# EAGLE design ATESLEME (EAGLE 9.6.2)

## Sheet 1 of 5
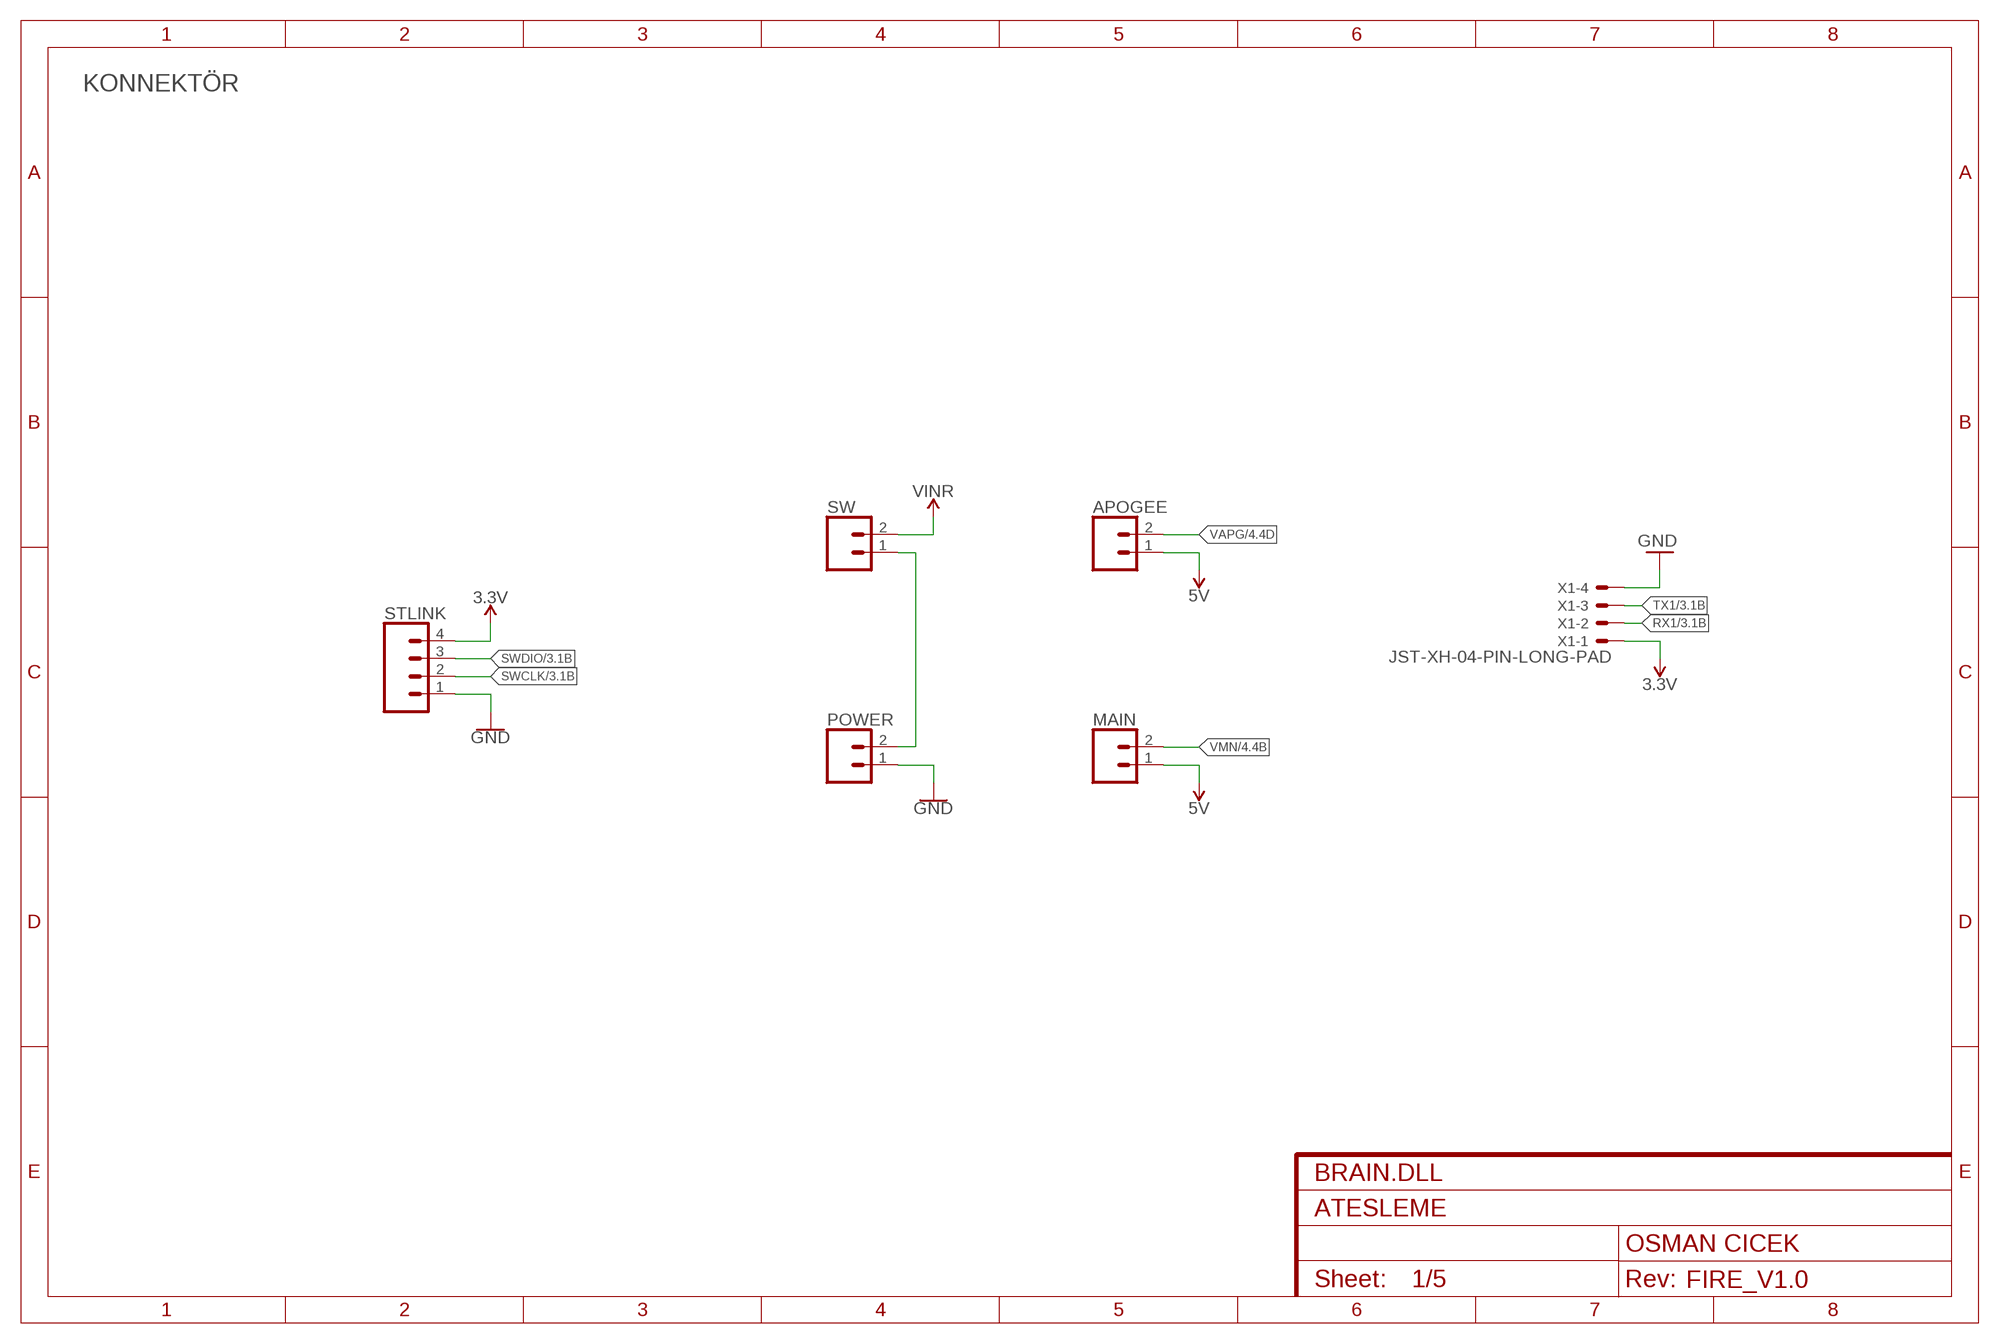
[diagram p0: schematic, sheet 1]
FRAME1 (FRAME-A4L): ATESLEME: PART1; CNAME: BRAIN.DLL; CREVISION: FIRE_V1.0; DESIGNER: OSMAN CICEK

### Parts
APOGEE  CONN_023.5MM-NO_SILK  [SCREWTERMINAL-3.5MM-2-NS]
MAIN  CONN_023.5MM-NO_SILK  [SCREWTERMINAL-3.5MM-2-NS]
POWER  CONN_023.5MM-NO_SILK  [SCREWTERMINAL-3.5MM-2-NS]
STLINK  CONN_04  [1X04]
SW  CONN_023.5MM-NO_SILK  [SCREWTERMINAL-3.5MM-2-NS]
X1  JST-XH-04-PIN-LONG-PAD  [JST-XH-04-PACKAGE-LONG-PAD]

### Nets
3.3V: STLINK.4 X1.1 ; also sheet 2,3,5
5V: APOGEE.1 MAIN.1 ; also sheet 2
GND: POWER.1 STLINK.1 X1.4 ; also sheet 2,3,4,5
N$9: POWER.2 SW.1
RX1: X1.2 ; also sheet 3
SWCLK: STLINK.2 ; also sheet 3
SWDIO: STLINK.3 ; also sheet 3
TX1: X1.3 ; also sheet 3
VAPG: APOGEE.2 ; also sheet 4
VIN: SW.2 ; supply symbol labelled VINR ; also sheet 2
VMN: MAIN.2 ; also sheet 4

### Notes on the sheet
- KONNEKTÖR

## Sheet 2 of 5
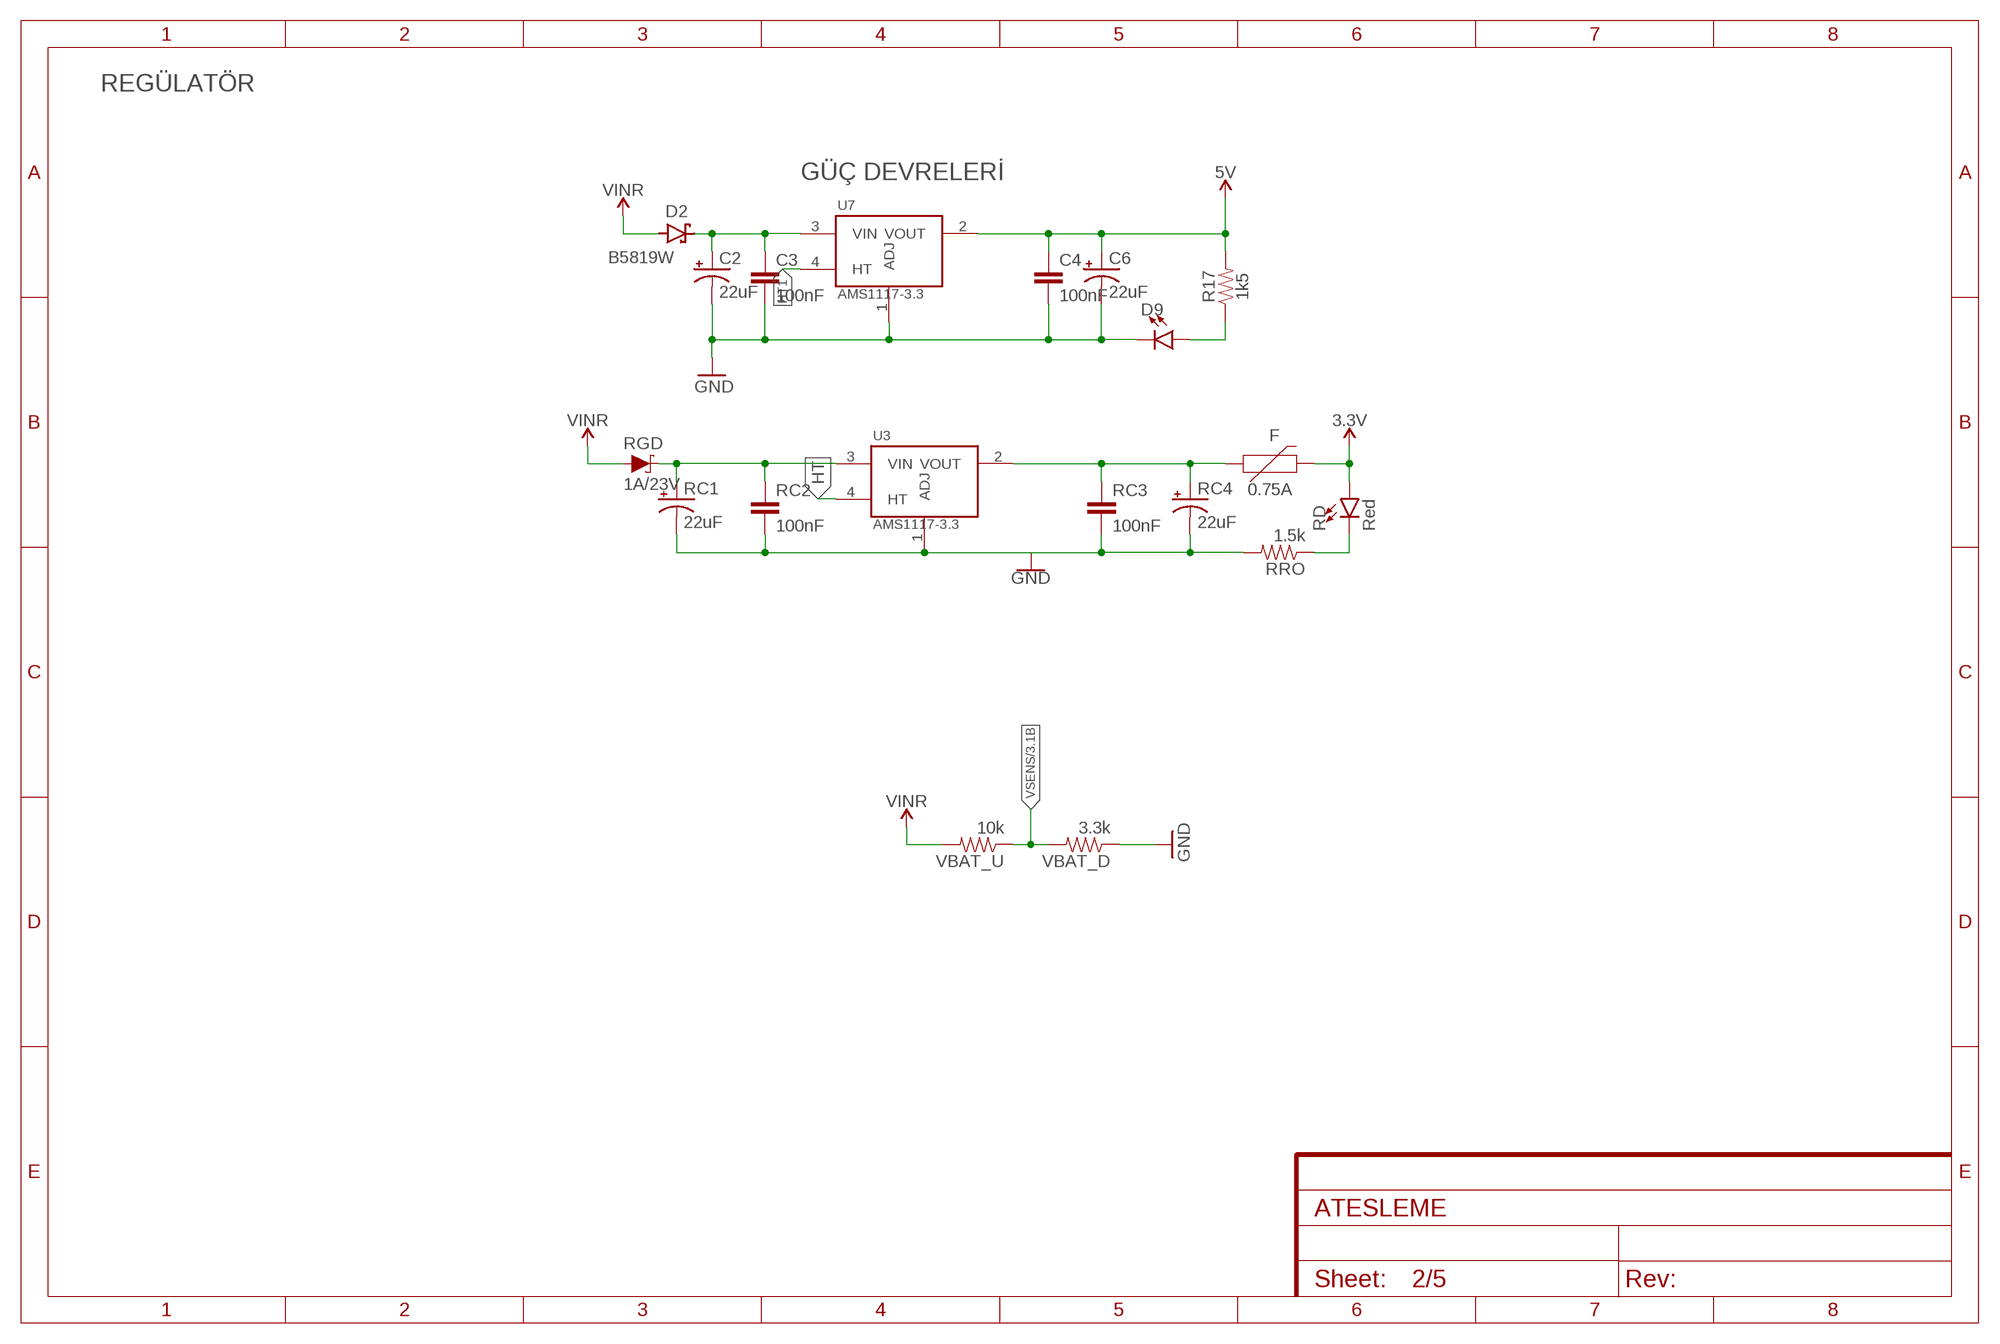
[diagram p1: schematic, sheet 2]

### Parts
C2  22uF  47UF-POLAR-EIA3528-10V-10%  [EIA3528]
C3  100nF  1.0UF-0603-16V-10%  [0603]
C4  100nF  1.0UF-0603-16V-10%  [0603]
C6  22uF  47UF-POLAR-EIA3528-10V-10%  [EIA3528]
D2  B5819W  SCHOTTKY_MBR0520LT1GDO-219  [SODFL3718X115]
D9  LED0603  [LED-0603]
F  0.75A  PPTC_THREE-QUARTER-AMP  [1206]
R17  1k5  1KOHM-0603-1/10W-1%  [0603]
RC1  22uF  10UF-POLAR-EIA3528-20V-10%(TANT)  [EIA3528]
RC2  100nF  0.1UF-0603-25V-(+80/-20%)  [0603]
RC3  100nF  0.1UF-0603-25V-(+80/-20%)  [0603]
RC4  22uF  10UF-POLAR-EIA3528-20V-10%(TANT)  [EIA3528]
RD  Red  LED-RED0603-SMART  [LED-0603]
RGD  1A/23V  DIODE-SCHOTTKY-BAT20J  [SOD-323]
RRO  1.5k  2.0KOHM1/10W5%(0603)  [0603-RES]
U3  AMS1117-3.3  [SOT229P700X180-4N]
U7  AMS1117-3.3  [SOT229P700X180-4N]
VBAT_D  3.3k  2.0KOHM1/10W5%(0603)  [0603-RES]
VBAT_U  10k  2.0KOHM1/10W5%(0603)  [0603-RES]

### Nets
3.3V: F.2 RD.A ; also sheet 1,3,5
5V: C4.1 C6.A(+) R17.2 U7.2(VOUT) ; also sheet 1
GND: C2.C(-) C3.2 C4.2 C6.C(-) D9.C RC1.C(-) RC2.2 RC3.2 RC4.C(-) RRO.2 U3.1(ADJ) U7.1(ADJ) VBAT_D.1 ; also sheet 1,3,4,5
HT: U3.4(HT)
HT1: U7.4(HT)
N$1: F.1 RC3.1 RC4.A(+) U3.2(VOUT)
N$2: RD.C RRO.1
N$7: C2.A(+) C3.1 D2.1(C) U7.3(VIN)
N$11: D9.A R17.1
VIN: D2.2(A) RGD.A VBAT_U.2 ; supply symbol labelled VINR ; also sheet 1
VNR: RC1.A(+) RC2.1 RGD.C U3.3(VIN)
VSENS: VBAT_D.2 VBAT_U.1 ; also sheet 3

### Notes on the sheet
- REGÜLATÖR
- GÜÇ DEVRELERİ

## Sheet 3 of 5
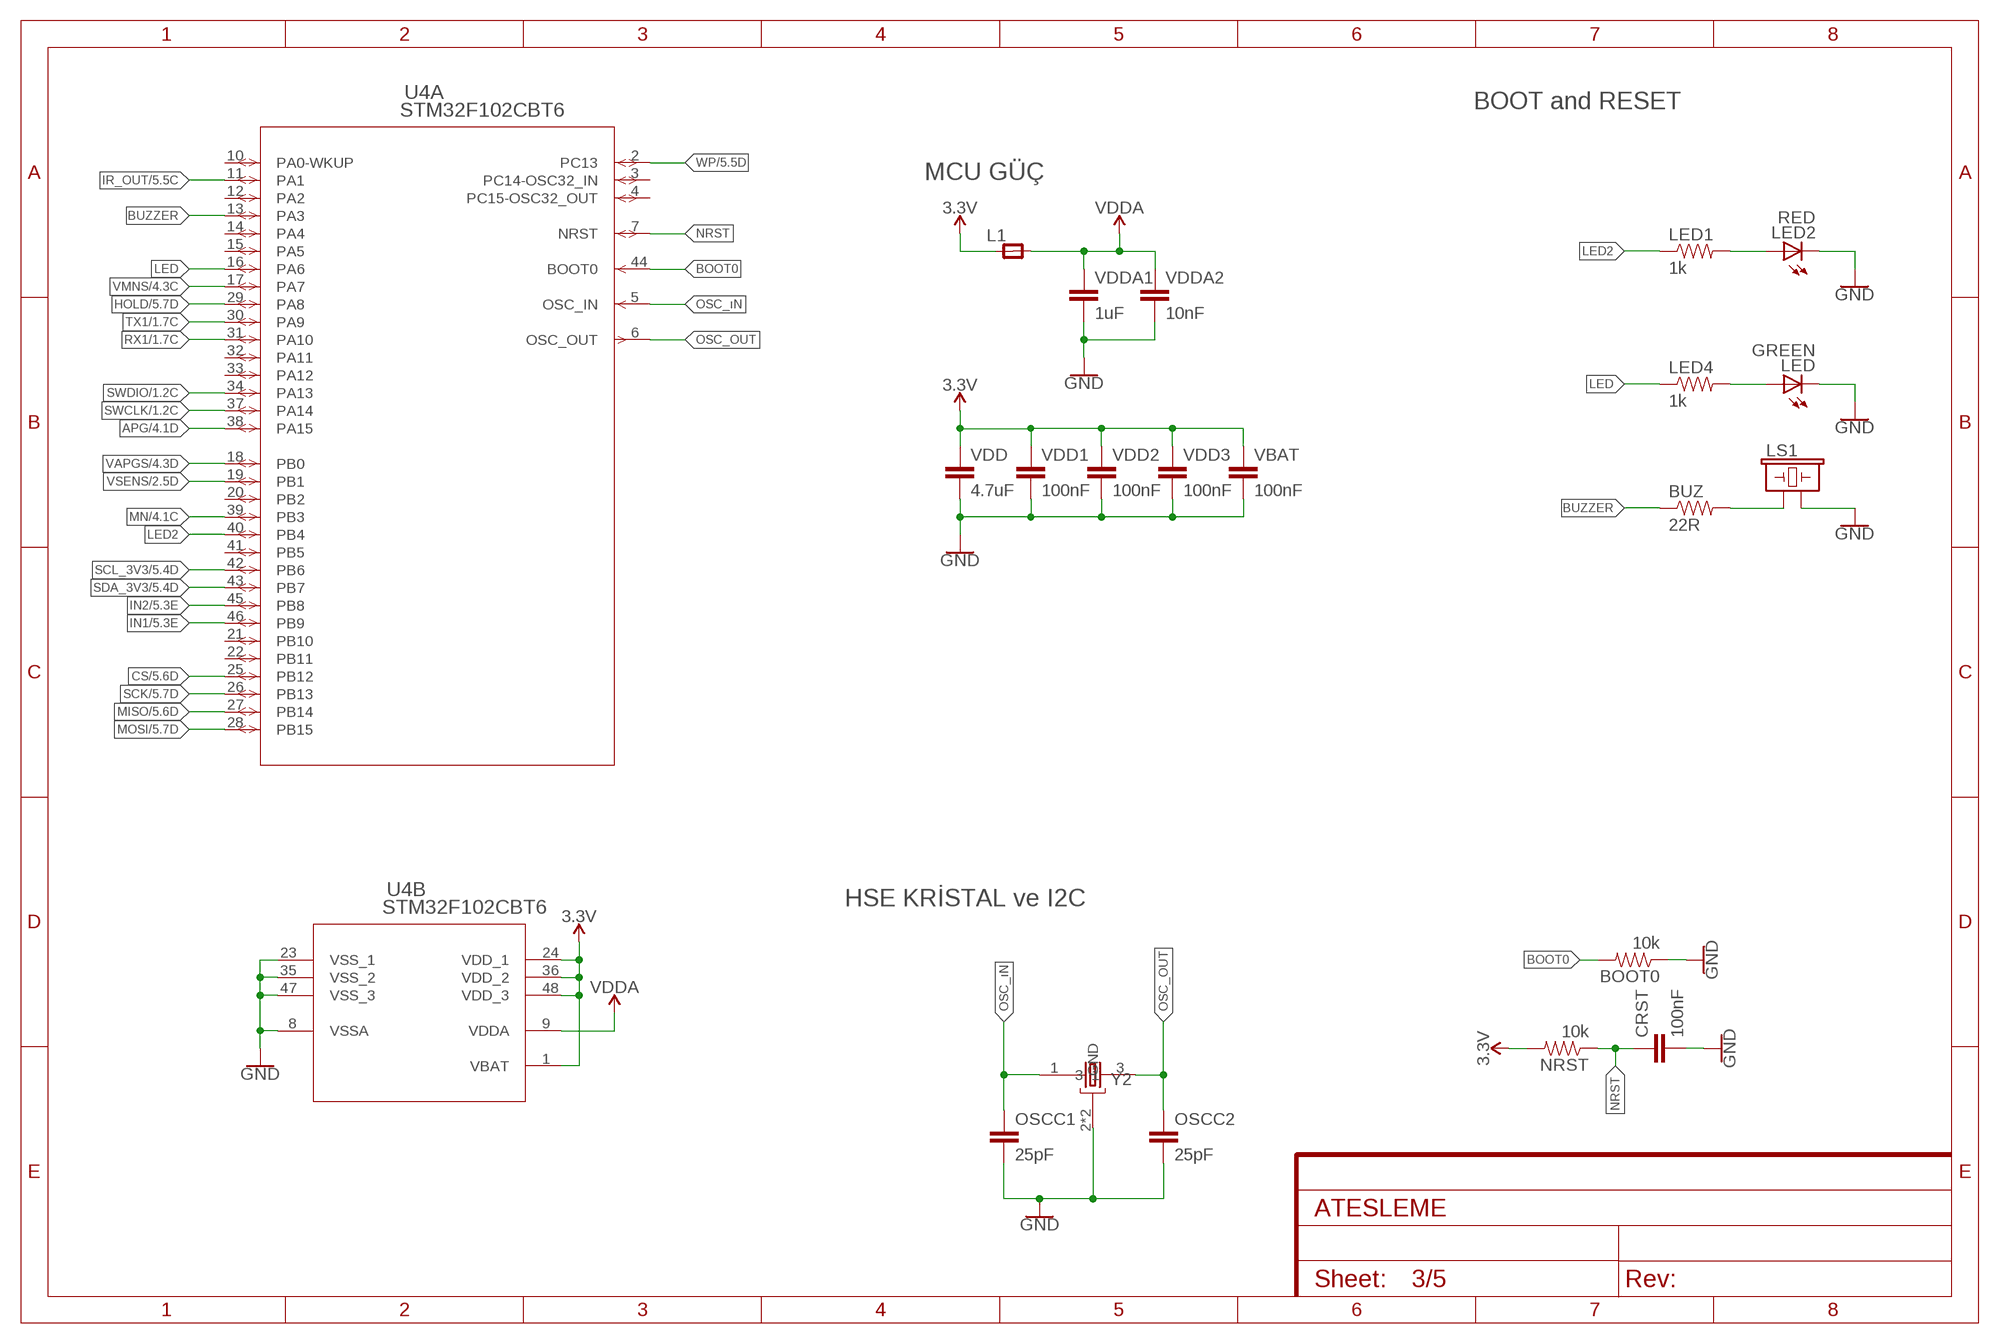
[diagram p2: schematic, sheet 3]

### Parts
BOOT0  10k  2.0KOHM1/10W5%(0603)  [0603-RES]
BUZ  22R  2.0KOHM1/10W5%(0603)  [0603-RES]
CRST  100nF  0.1UF-0603-25V-(+80/-20%)  [0603]
L1  RC-MASTER-SMD_FB_0805MP  [RC-MASTER-SMD_L0805MP]
LED  GREEN  LED-RED0603  [LED-0603]
LED1  1k  2.0KOHM1/10W5%(0603)  [0603-RES]
LED2  RED  LED-RED0603  [LED-0603]
LED4  1k  2.0KOHM1/10W5%(0603)  [0603-RES]
LS1  BUZZER-PTH  [BUZZER-12MM]
NRST  10k  2.0KOHM1/10W5%(0603)  [0603-RES]
OSCC1  25pF  0.1UF-0603-25V-(+80/-20%)  [0603]
OSCC2  25pF  0.1UF-0603-25V-(+80/-20%)  [0603]
U4  STM32F102CBT6  [LQFP48-7X7MM]
VBAT  100nF  0.1UF-0603-25V-(+80/-20%)  [0603]
VDD  4.7uF  0.1UF-0603-25V-(+80/-20%)  [0603]
VDD1  100nF  0.1UF-0603-25V-(+80/-20%)  [0603]
VDD2  100nF  0.1UF-0603-25V-(+80/-20%)  [0603]
VDD3  100nF  0.1UF-0603-25V-(+80/-20%)  [0603]
VDDA1  1uF  0.1UF-0603-25V-(+80/-20%)  [0603]
VDDA2  10nF  0.1UF-0603-25V-(+80/-20%)  [0603]
Y2  ABM2B-8.000MHZ-10-1-U-T  ABM3B-26.000MHZ-10-1-U-T  [OSCCC500X320X110-4N]

### Nets
3.3V: L1.1 NRST.2 U4.1(B:VBAT) U4.24(B:VDD_1) U4.36(B:VDD_2) U4.48(B:VDD_3) VBAT.1 VDD1.1 VDD2.1 VDD3.1 VDD.1 ; also sheet 1,2,5
APG: U4.38(A:PA15) ; also sheet 4
BOOT0: BOOT0.2 U4.44(A:BOOT0)
BUZZER: BUZ.1 U4.13(A:PA3)
CS: U4.25(A:PB12) ; also sheet 5
GND: BOOT0.1 CRST.2 LED2.C LED.C LS1.- OSCC1.2 OSCC2.2 U4.8(B:VSSA) U4.23(B:VSS_1) U4.35(B:VSS_2) U4.47(B:VSS_3) VBAT.2 VDD1.2 VDD2.2 VDD3.2 VDD.2 VDDA1.2 VDDA2.2 Y2.2(GND) Y2.4(GND) ; also sheet 1,2,4,5
HOLD: U4.29(A:PA8) ; also sheet 5
IN1: U4.46(A:PB9) ; also sheet 5
IN2: U4.45(A:PB8) ; also sheet 5
IR_OUT: U4.11(A:PA1) ; also sheet 5
LED: LED4.1 U4.16(A:PA6)
LED2: LED1.1 U4.40(A:PB4)
MISO: U4.27(A:PB14) ; also sheet 5
MN: U4.39(A:PB3) ; also sheet 4
MOSI: U4.28(A:PB15) ; also sheet 5
N$6: LED1.2 LED2.A
N$10: LED4.2 LED.A
N$13: BUZ.2 LS1.+
NRST: CRST.1 NRST.1 U4.7(A:NRST)
OSC_OUT: OSCC2.1 U4.6(A:OSC_OUT) Y2.3
OSC_ıN: OSCC1.1 U4.5(A:OSC_IN) Y2.1
RX1: U4.31(A:PA10) ; also sheet 1
SCK: U4.26(A:PB13) ; also sheet 5
SCL_3V3: U4.42(A:PB6) ; also sheet 5
SDA_3V3: U4.43(A:PB7) ; also sheet 5
SWCLK: U4.37(A:PA14) ; also sheet 1
SWDIO: U4.34(A:PA13) ; also sheet 1
TX1: U4.30(A:PA9) ; also sheet 1
VAPGS: U4.18(A:PB0) ; also sheet 4
VDDA: L1.2 U4.9(B:VDDA) VDDA1.1 VDDA2.1
VMNS: U4.17(A:PA7) ; also sheet 4
VSENS: U4.19(A:PB1) ; also sheet 2
WP: U4.2(A:PC13) ; also sheet 5
Unconnected: U4.3(A:PC14-OSC32_IN) U4.4(A:PC15-OSC32_OUT) U4.10(A:PA0-WKUP) U4.12(A:PA2) U4.14(A:PA4) U4.15(A:PA5) U4.20(A:PB2) U4.21(A:PB10) U4.22(A:PB11) U4.32(A:PA11) U4.33(A:PA12) U4.41(A:PB5)

### Notes on the sheet
- BOOT and RESET
- MCU GÜÇ
- HSE KRİSTAL ve I2C

## Sheet 4 of 5
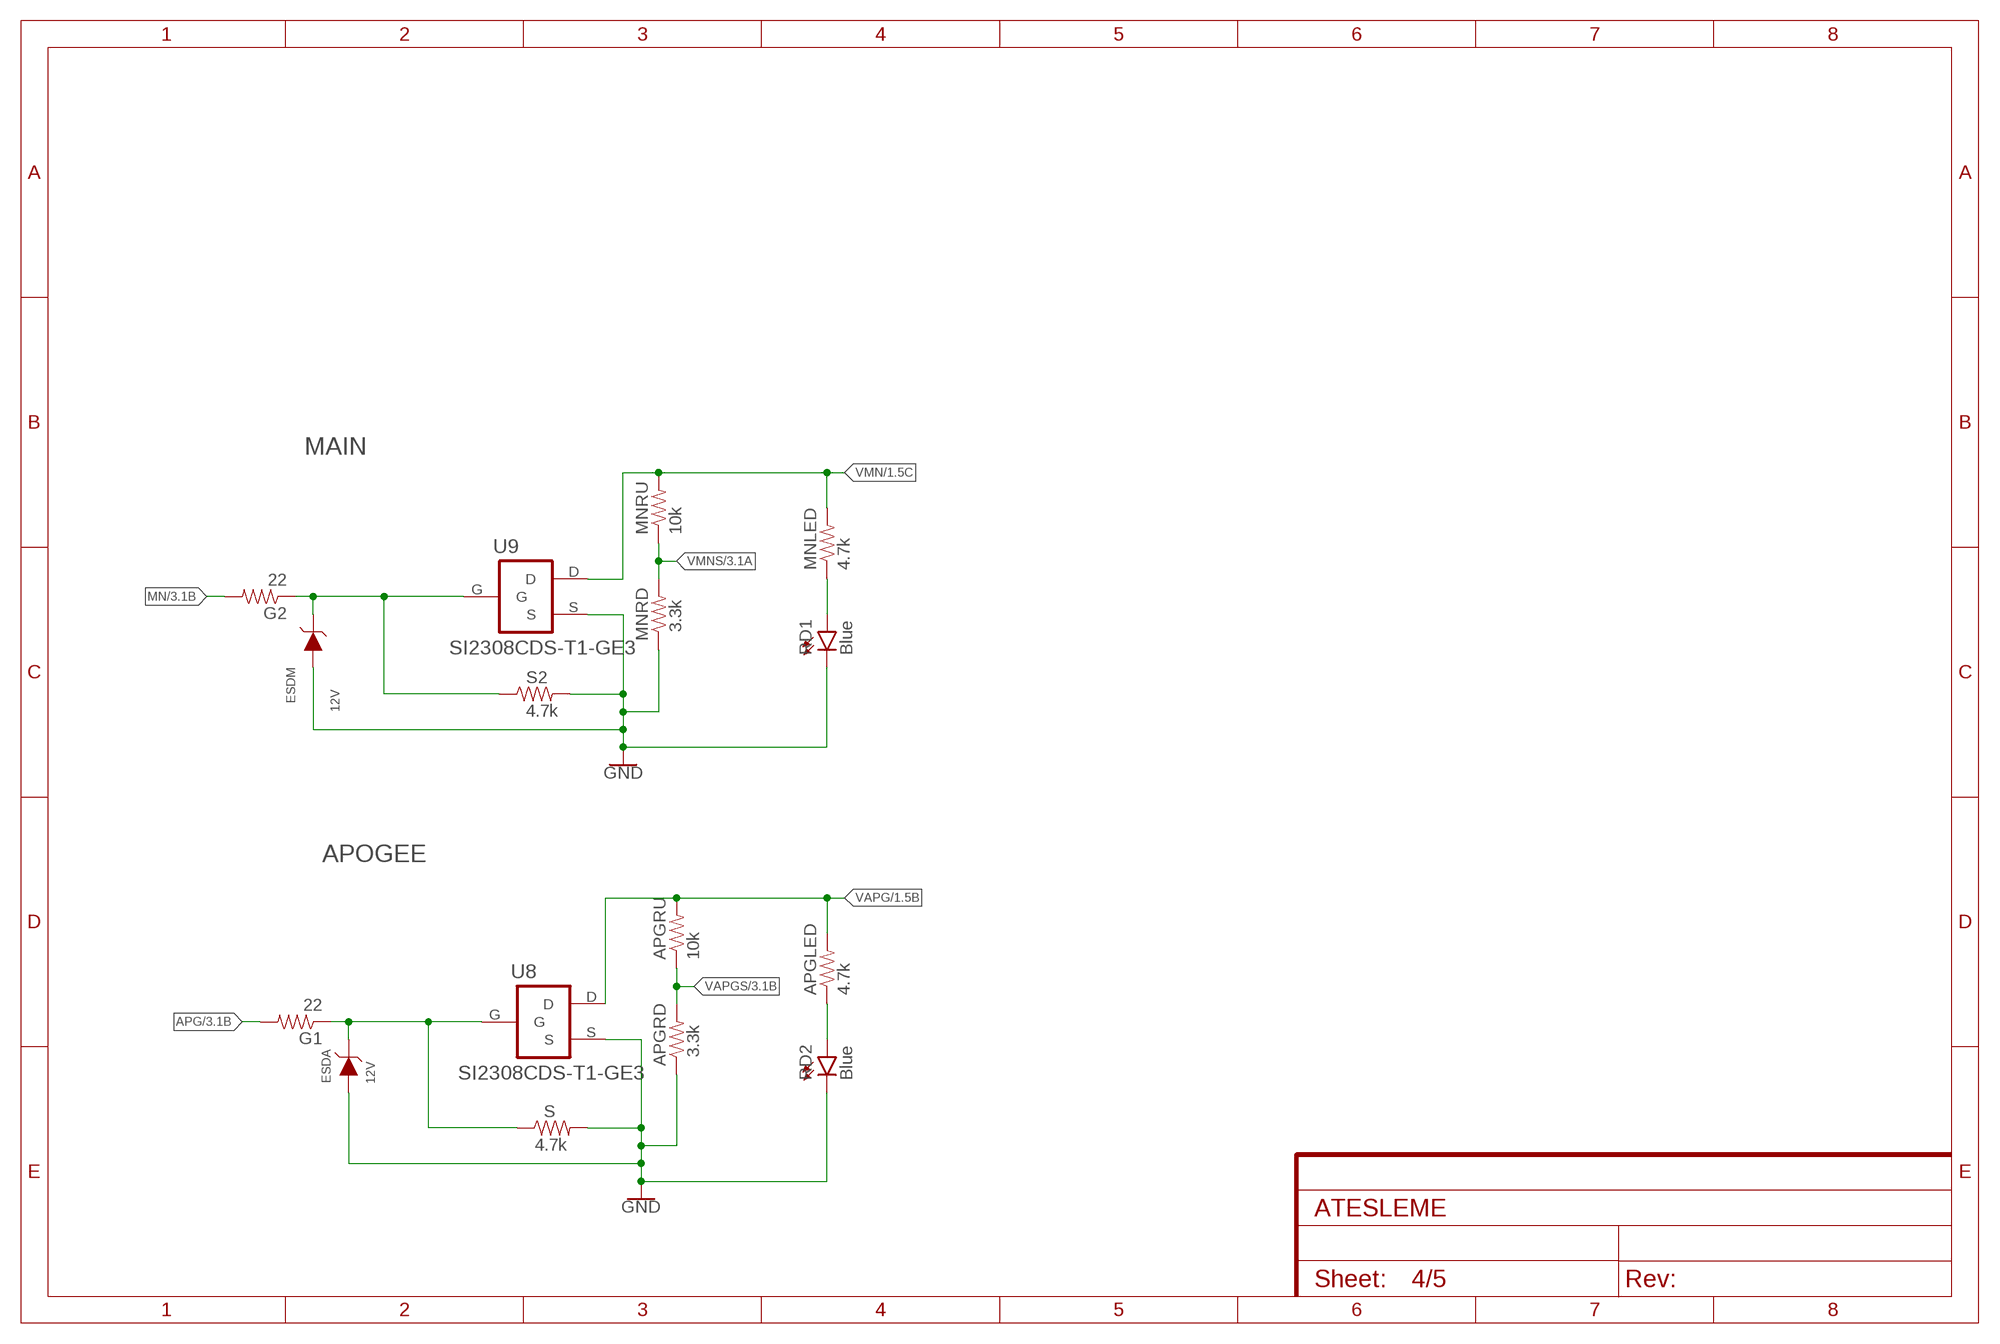
[diagram p3: schematic, sheet 4]

### Parts
APGLED  4.7k  2.0KOHM1/10W5%(0603)  [0603-RES]
APGRD  3.3k  2.0KOHM1/10W5%(0603)  [0603-RES]
APGRU  10k  2.0KOHM1/10W5%(0603)  [0603-RES]
ESDA  12V  WE-TVSP_DO-214AC_400W_UNI_824500102  [WE-TVSP_DO-214AC_UNIDIRECTIONAL]
ESDM  12V  WE-TVSP_DO-214AC_400W_UNI_824500102  [WE-TVSP_DO-214AC_UNIDIRECTIONAL]
G1  22  2.0KOHM1/10W5%(0603)  [0603-RES]
G2  22  2.0KOHM1/10W5%(0603)  [0603-RES]
MNLED  4.7k  2.0KOHM1/10W5%(0603)  [0603-RES]
MNRD  3.3k  2.0KOHM1/10W5%(0603)  [0603-RES]
MNRU  10k  2.0KOHM1/10W5%(0603)  [0603-RES]
RD1  Blue  LED-RED0603-SMART  [LED-0603]
RD2  Blue  LED-RED0603-SMART  [LED-0603]
S  4.7k  2.0KOHM1/10W5%(0603)  [0603-RES]
S2  4.7k  2.0KOHM1/10W5%(0603)  [0603-RES]
U8  SI2308CDS-T1-GE3  IRLML6344TRPBF  [SOT95P240X112-3N]
U9  SI2308CDS-T1-GE3  IRLML6344TRPBF  [SOT95P240X112-3N]

### Nets
APG: G1.2 ; also sheet 3
GND: APGRD.1 ESDA.2(A) ESDM.2(A) MNRD.1 RD1.C RD2.C S2.2 S.2 U8.S U9.S ; also sheet 1,2,3,5
MN: G2.2 ; also sheet 3
N$3: MNLED.1 RD1.A
N$4: APGLED.1 RD2.A
N$8: ESDM.1(C) G2.1 S2.1 U9.G
N$14: ESDA.1(C) G1.1 S.1 U8.G
VAPG: APGLED.2 APGRU.2 U8.D ; also sheet 1
VAPGS: APGRD.2 APGRU.1 ; also sheet 3
VMN: MNLED.2 MNRU.2 U9.D ; also sheet 1
VMNS: MNRD.2 MNRU.1 ; also sheet 3

### Notes on the sheet
- MAIN
- APOGEE

## Sheet 5 of 5
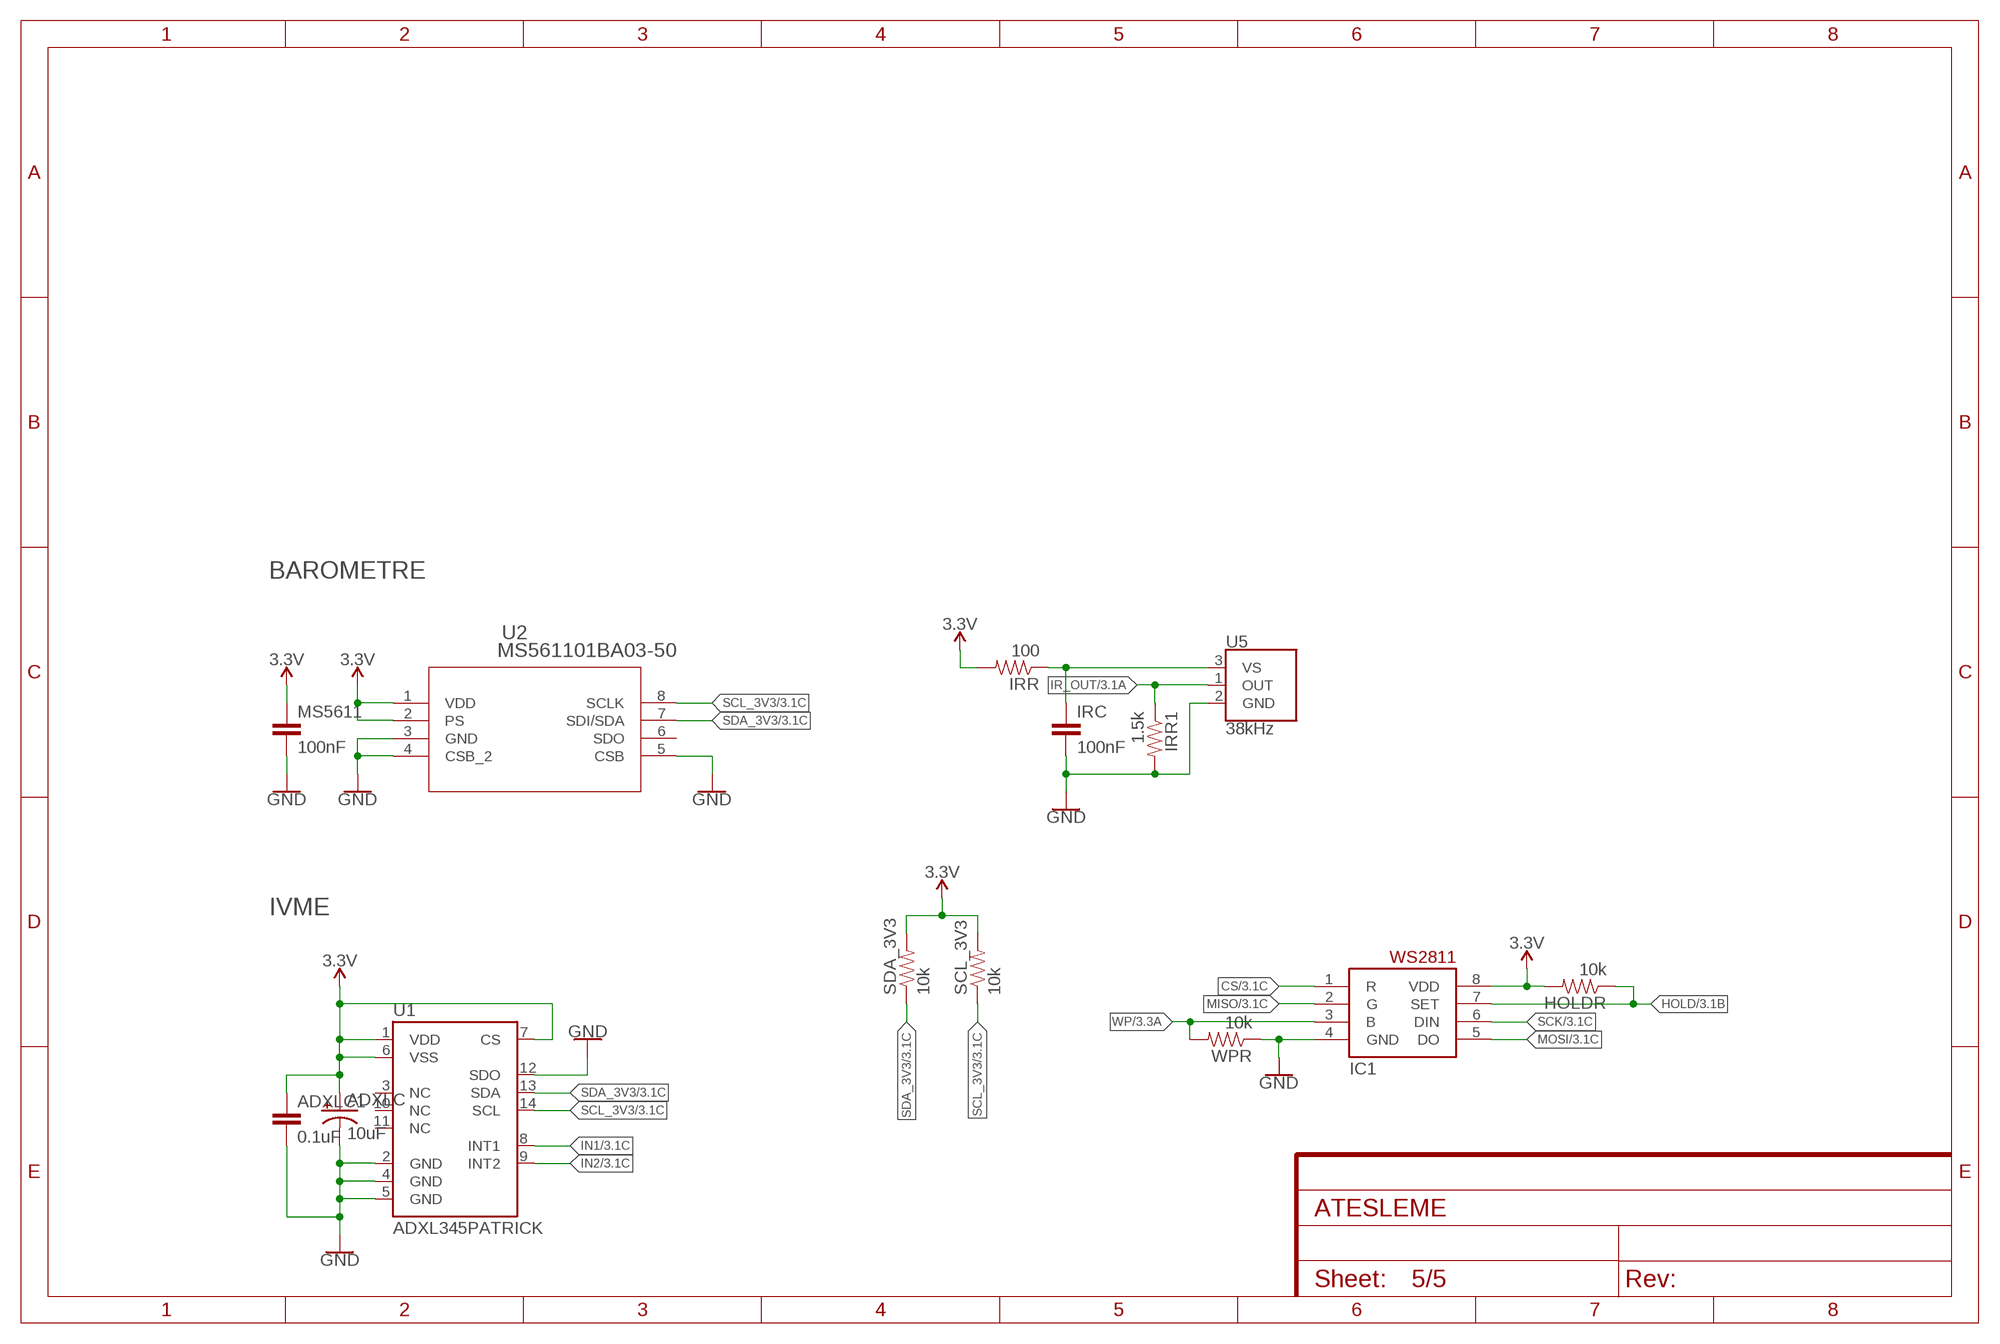
[diagram p4: schematic, sheet 5]

### Parts
ADXLC  10uF  10UF-POLAR-EIA3216-16V-10%(TANT)  [EIA3216]
ADXLC1  0.1uF  0.1UF-0603-25V-(+80/-20%)  [0603]
HOLDR  10k  2.0KOHM1/10W5%(0603)  [0603-RES]
IC1  EN25F40-100GCP-TR  WS2811-SOP8  [SO08-SKINNYPADS]
IRC  100nF  0.1UF-0603-25V-(+80/-20%)  [0603]
IRR  100  2.0KOHM1/10W5%(0603)  [0603-RES]
IRR1  1.5k  2.0KOHM1/10W5%(0603)  [0603-RES]
MS5611  100nF  0.1UF-0603-25V-(+80/-20%)  [0603]
SCL_3V3  10k  2.0KOHM1/10W5%(0603)  [0603-RES]
SDA_3V3  10k  2.0KOHM1/10W5%(0603)  [0603-RES]
U1  ADXL345PATRICK  [LGA14_1:1_PATRICK]
U2  MS561101BA03-50  [SON8_MS5611_TEC]
U5  38kHz  TSOP38238  [TSOP382]
WPR  10k  2.0KOHM1/10W5%(0603)  [0603-RES]

### Nets
3.3V: ADXLC1.1 ADXLC.+ HOLDR.2 IC1.8(VDD) IRR.2 MS5611.1 SCL_3V3.2 SDA_3V3.2 U1.1(VDD) U1.6(VSS) U1.7(CS) U2.1(VDD) U2.2(PS) ; also sheet 1,2,3
CS: IC1.1(R) ; also sheet 3
GND: ADXLC1.2 ADXLC.- IC1.4(GND) IRC.2 IRR1.2 MS5611.2 U1.2(GND) U1.4(GND) U1.5(GND) U1.12(SDO) U2.3(GND) U2.4(CSB_2) U2.5(CSB) U5.2(GND) WPR.1 ; also sheet 1,2,3,4
HOLD: HOLDR.1 IC1.7(SET) ; also sheet 3
IN1: U1.8(INT1) ; also sheet 3
IN2: U1.9(INT2) ; also sheet 3
IR_OUT: IRR1.1 U5.1(OUT) ; also sheet 3
MISO: IC1.2(G) ; also sheet 3
MOSI: IC1.5(DO) ; also sheet 3
N$5: IRC.1 IRR.1 U5.3(VS)
SCK: IC1.6(DIN) ; also sheet 3
SCL_3V3: SCL_3V3.1 U1.14(SCL) U2.8(SCLK) ; also sheet 3
SDA_3V3: SDA_3V3.1 U1.13(SDA) U2.7(SDI/SDA) ; also sheet 3
WP: IC1.3(B) WPR.2 ; also sheet 3
Unconnected: U1.3(NC) U1.10(NC) U1.11(NC) U2.6(SDO)

### Notes on the sheet
- BAROMETRE
- IVME

## Library data of the parts
ADXLC = SparkFun-Capacitors:10UF-POLAR: 10.0µF polarized capacitors A capacitor is a passive two-terminal electrical component used to store electrical energy temporarily in an electric field.; PROD_ID: CAP-00811
ADXLC1 = SparkFun-Capacitors:0.1UF: 0.1µF ceramic capacitors A capacitor is a passive two-terminal electrical component used to store electrical energy temporarily in an electric field.; PROD_ID: CAP-00810
APGLED APGRD APGRU BOOT0 BUZ G1 G2 HOLDR IRR IRR1 LED1 LED4 MNLED MNRD MNRU NRST RRO S S2 SCL_3V3 SDA_3V3 VBAT_D VBAT_U WPR = SparkFun-Resistors:2.0KOHM1/10W5%(0603): RES-08296; PROD_ID: RES-08296; VALUE: 2.0k
APOGEE MAIN POWER SW = SparkFun-Connectors:CONN_02: Multi connection point. Often used as Generic Header-pin footprint for 0.1 inch spaced/style header connections On any of the 0.1 inch spaced packages, you can populate with these: Break Away Headers - Straight <https://www.sparkfun.com/products/116> (PRT-00116) Break Away Male Headers - Right Angle <https://www.sparkfun.com/products/553> (PRT-00553) Female Headers <https://www.sparkfun.com/products/115> (PRT-00115) Break Away Headers - Machine Pin <https://www.sparkfun.com/products/117> (PRT-00117) Break Away Female Headers - Swiss Machine Pin <https://www.sparkfun.com/products/743> (PRT-00743) For SCREWTERMINALS and SPRING TERMINALS visit here: Screw Terimnals on SparkFun.com <https://www.sparkfun.com/search/results?term=Screw+Terminals> (5mm/3.5mm/2.54mm spacing) This device is also useful as a general connection point to wire up your design to another part of your project. Our various solder wires solder well into these plated through hole pads. Hook-Up Wire - Assortment (Stranded, 22 AWG) <https://www.sparkfun.com/products/11375> (PRT-11375) Hook-Up Wire - Assortment (Solid Core, 22 AWG) <https://www.sparkfun.com/products/11367> (PRT-11367) View the entire wire category on our website here <https://www.sparkfun.com/categories/141> Special notes: Molex polarized connector foot print use with: PRT-08233 with associated crimp pins and housings. 2.54_SCREWTERM for use with PRT-10571. 3.5mm Screw Terminal footprints for PRT-08084 5mm Screw Terminal footprints for use with PRT-08432; PROD_ID: CONN-08399
C2 C6 = SparkFun-Capacitors:47UF-POLAR: 47µF polarized capacitors A capacitor is a passive two-terminal electrical component used to store electrical energy temporarily in an electric field.; PROD_ID: CAP-08310; VALUE: 47uF
C3 C4 = SparkFun-Capacitors:1.0UF: 1µF ceramic capacitors A capacitor is a passive two-terminal electrical component used to store electrical energy temporarily in an electric field.; PROD_ID: CAP-00868; VALUE: 1.0uF
CRST IRC MS5611 OSCC1 OSCC2 RC2 RC3 VBAT VDD VDD1-VDD3 VDDA1 VDDA2 = SparkFun-Capacitors:0.1UF: 0.1µF ceramic capacitors A capacitor is a passive two-terminal electrical component used to store electrical energy temporarily in an electric field.; PROD_ID: CAP-00810; VALUE: 0.1uF
D2 = Diode:SCHOTTKY_: Schottky Diode - Popular parts; CATEGORY: Diode; DESCRIPTION: DIODE SCHOTTKY 20V 500MA SOD123; MANUFACTURER: ON Semiconductor; MPN: MBR0520LT1G; SUB-CATEGORY: Schottky; VALUE: MBR0520LT1G
D9 = SparkFun-LED:LED: LED (Generic) Standard schematic elements and footprints for 5mm, 3mm, 1206, and 0603 sized LEDs. Generic LEDs with no color specified.
ESDA ESDM = Wurth_EMC Components_WE-TVSP:WE-TVSP_DO-214AC_400W_UNI: WE-TVSP Power TVS Diode Characteristics Low Profile Package Glass passivated Juction Excellent clamping capability Fast response time MSL Level 1, per J-STD-020 Classification of the plastic case: UL 94 V-0 Safety certification UL 497B, E478010 Identical design: - DO-214AC = SMAJ - DO-214AA = SMBJ - DO-214AB = SMCJ/SMDJ Applications Ideal to protect the I/O Interfaces, Bus Voltage and other circuits of sensetive electronic equipment against voltage transiensts <https://www.we-online.com/catalog/media/o55793v209%20WE-TVSP_600W-3000W_D0214AA_4C.jpg> Details see: https://www.we-online.com/catalog/en/WE-TVSP/ Updated by Ella Wu 2020-07-20 2020 (C) Würth Elektronik; DATASHEET-URL: https://www.we-online.com/catalog/datasheet/824500102.pdf; IPEAK: 2.5A; MOUNT: SMT; PART-NUMBER: 824500102; PDISS: 400W; VALUE: 100V; VBR: 117V; VCLAMP: 162V
F = SparkFun-Fuses:PPTC: Resettable Fuse PPTC Resettable Fuse. Really a sort of resistor with a polymeric positive temperature coefficient whose resistance increases dramatically with an increase in temperature. When heated by the power passing through the resistance rises causing the current to be limited, protecting the circuit. This is achieved by the transition of the polymer from a crystalline to an amorphous state where the conductive carbon separates breaking the conductive pathways found in the cool crystalline structure. When a PPTC cools back down it resumes conducting letting the circuit turn back on. SparkFun Products: SparkFun RedBoard - Programmed with Arduino <https://www.sparkfun.com/products/12757> Pro Micro - 5V/16MHz <https://www.sparkfun.com/products/12640> Arduino Pro 328 - 5V/16MHz <https://www.sparkfun.com/products/10915> MP3 Trigger <https://www.sparkfun.com/products/13720>; PROD_ID: RES-11150; VALUE: 6V/0.75A
IC1 = adafruit:WS2811
L1 = 52101-101-REV-A_v16:RC-MASTER-SMD_FB_: FERRITE BEAD
LED = SparkFun-LED:LED-RED: Assorted Red LEDs LilyPad 1206- DIO-09912 1206- DIO-00809 0603- DIO-00819; PROD_ID: DIO-00819; VALUE: RED
LED2 = SparkFun-LED:LED-RED: Assorted Red LEDs LilyPad 1206- DIO-09912 1206- DIO-00809 0603- DIO-00819; PROD_ID: DIO-00819
LS1 = SparkFun-Electromechanical:BUZZER: Buzzer Small round buzzers that operate around the audible 2kHz range. You can use these as speakers to create simple music or user interfaces. Variant Overview: PTH - Mini Speaker - PC Mount 12mm 2.048kHz <https://www.sparkfun.com/products/7950> PTH_KIT - Mini Speaker - PC Mount 12mm 2.048kHz <https://www.sparkfun.com/products/7950> KIT simplifies soldering by adding stop mask to one side of the pads. PTH_NO_SILK - Mini Speaker - PC Mount 12mm 2.048kHz <https://www.sparkfun.com/products/7950> No silkscreen indicator of buzzer outline. PTH_KIT_NO_SILK - Mini Speaker - PC Mount 12mm 2.048kHz <https://www.sparkfun.com/products/7950> KIT package w/o silkscreen SMD - Buzzer Audio Magnetic (CCV-084B16) SMD buzzer used on, e.g. the LilyPad Buzzer <https://www.sparkfun.com/products/8463> and RFID USB Reader <https://www.sparkfun.com/products/9963>. SMD_KIT - Buzzer Audio Magnetic (CCV-084B16) SMD Buzzer with elongated pins to make soldering easier. Used on the SparkFun Simon Says - Surface Mount Soldering Kit <https://www.sparkfun.com/products/10935>.; PROD_ID: COMP-08253; SF_SKU: COM-07950
R17 = SparkFun-Resistors:1KOHM: 1kΩ resistor A resistor is a passive two-terminal electrical component that implements electrical resistance as a circuit element. Resistors act to reduce current flow, and, at the same time, act to lower voltage levels within circuits. - Wikipedia; PROD_ID: RES-07856; VALUE: 1k
RC1 RC4 = SparkFun-Capacitors:10UF-POLAR: 10.0µF polarized capacitors A capacitor is a passive two-terminal electrical component used to store electrical energy temporarily in an electric field.; PROD_ID: CAP-08063; VALUE: 10uF
RD = SparkFun-LED:LED-RED: Red SMD LED Used in manufacturing of most products at SparkFun Packages: 0603 - SMD 0603 package [Product Link] <http://docs.avagotech.com/docs/AV02-0551EN> 0603 SMART - SMD 0603 SMART package ( more efficient and expensive)[Product Link] <http://www.osram-os.com/Graphics/XPic2/00077099_0.pdf> 1206 - SMD1206 package [Product Link] <https://www.sparkfun.com/datasheets/DevTools/LilyPad/Q150OVS4.pdff> SparkFun Products: Pro Mini 328 -5V <https://www.sparkfun.com/products/821> RedBoard <https://www.sparkfun.com/products/12757> IOIO-OTG <https://www.sparkfun.com/products/13613>; PROD_ID: DIO-11154
RD1 RD2 = SparkFun-LED:LED-RED: Red SMD LED Used in manufacturing of most products at SparkFun Packages: 0603 - SMD 0603 package [Product Link] <http://docs.avagotech.com/docs/AV02-0551EN> 0603 SMART - SMD 0603 SMART package ( more efficient and expensive)[Product Link] <http://www.osram-os.com/Graphics/XPic2/00077099_0.pdf> 1206 - SMD1206 package [Product Link] <https://www.sparkfun.com/datasheets/DevTools/LilyPad/Q150OVS4.pdff> SparkFun Products: Pro Mini 328 -5V <https://www.sparkfun.com/products/821> RedBoard <https://www.sparkfun.com/products/12757> IOIO-OTG <https://www.sparkfun.com/products/13613>; PROD_ID: DIO-11154; VALUE: Red
RGD = SparkFun-DiscreteSemi:DIODE-SCHOTTKY: Schottky diode A Schottky diode is a semiconductor diode which has a low forward voltage drop and a very fast switching action.; PROD_ID: DIO-11623; VALUE: 1A/23V/620mV
STLINK = SparkFun-Connectors:CONN_04: Multi connection point. Often used as Generic Header-pin footprint for 0.1 inch spaced/style header connections On any of the 0.1 inch spaced packages, you can populate with these: Break Away Headers - Straight <https://www.sparkfun.com/products/116> (PRT-00116) Break Away Male Headers - Right Angle <https://www.sparkfun.com/products/553> (PRT-00553) Female Headers <https://www.sparkfun.com/products/115> (PRT-00115) Break Away Headers - Machine Pin <https://www.sparkfun.com/products/117> (PRT-00117) Break Away Female Headers - Swiss Machine Pin <https://www.sparkfun.com/products/743> (PRT-00743) For SCREWTERMINALS and SPRING TERMINALS visit here: Screw Terimnals on SparkFun.com <https://www.sparkfun.com/search/results?term=Screw+Terminals> (5mm/3.5mm/2.54mm spacing) This device is also useful as a general connection point to wire up your design to another part of your project. Our various solder wires solder well into these plated through hole pads. Hook-Up Wire - Assortment (Stranded, 22 AWG) <https://www.sparkfun.com/products/11375> (PRT-11375) Hook-Up Wire - Assortment (Solid Core, 22 AWG) <https://www.sparkfun.com/products/11367> (PRT-11367) View the entire wire category on our website here <https://www.sparkfun.com/categories/141> Special notes: Molex polarized connector foot print use with SKU : PRT-08231 with associated crimp pins and housings. 1MM SMD Version SKU: PRT-10208; PROD_ID: CONN-09696
U1 = Testing:ADXL345
U2 = MS5611:MS561101BA03-50; BUILT_BY: EMA_UL_Team; COPYRIGHT: Copyright (C) 2016 Accelerated Designs. All rights reserved; DESCRIPTION: MS5611 BAROMETRIC SENSOR CM T&R; MANUFACTURER_PART_NUMBER: MS561101BA03-50; OUTPUT-SPAN: 24 bit ADC; PACKAGE: Surface Mountable; PRODUCT_DESCRIPTION: MS5611 BAROMETRIC SENSOR CM T&R; PRODUCT_TYPE: -; SENSOR_TYPE: Digital Pressure and Altimeter Sensor Modules; SOURCELIBRARY: TE_Connectivity-2018-03-16; SUPPLY_VOLTAGE: 1.8  3.6; TE_PART_NUMBER: MS561101BA03-50; VENDOR: TE Connectivity
U3 U7 = AMS1117-3.3:AMS1117-3.3: Sot223/Pkg 1-Amp 3.3-Volt Low Drop Out Voltage Regulatator; AVAILABILITY: Unavailable; DESCRIPTION: Sot223/Pkg 1-Amp 3.3-Volt Low Drop Out Voltage Regulatator; MF: Advanced Monolithic Systems; MP: AMS1117-3.3; PACKAGE: SOT-89 ams; PRICE: None
U4 = STM32F102CBT6:STM32F102CBT6; BUILT_BY: EMA_UL_Team; COPYRIGHT: Copyright (C) 2018 Accelerated Designs. All rights reserved; MANUFACTURER_PART_NUMBER: STM32F102CBT6; SOURCELIBRARY: Updates_to_database_2020-10-19; VENDOR: STMicroelectronics
U5 = SparkFun-Sensors:TSOP382: Vishay Semiconductor TSOP32838 - 38kHz IR Receiver These products are miniaturized IR receiver modules for infrared remote control systems. A PIN diode and a preamplifier are assembled on a leadframe, the epoxy package contains an IR filter. The demodulated output signal can be directly connected to a microprocessor for decoding.; PROD_ID: SEN-14114
U8 U9 = IRLML6344TRPBF:IRLML6344TRPBF: Power MOSFET Check prices <https://pricing.snapeda.com/parts/IRLML6344TRPBF/Infineon%20Technologies/view-part?ref=eda>; AVAILABILITY: Good; DESCRIPTION: N-Channel 30V 5A (Ta) 1.3W (Ta) Surface Mount Micro3™/SOT-23; MF: Infineon Technologies; MP: IRLML6344TRPBF; PACKAGE: SOT-23 Multicomp; PRICE: None; PURCHASE-URL: https://pricing.snapeda.com/search/part/IRLML6344TRPBF/?ref=eda
X1 = Rembrandt Electronics - JST XH Connectors v1-0:JST-XH-04-PIN: JST XH Connector 2 Pin Wire to board connector. Pitch: 2,54 mm, (0.100") Number of pins: 4 Created by Rembrandt Electronics www.rembrandtelectronics.com
Y2 = ABM3B-26.000MHZ-10-1-U-T:ABM3B-26.000MHZ-10-1-U-T: Ceramic SMD Crystal Check prices <https://pricing.snapeda.com/parts/ABM3B-26.000MHZ-10-1-U-T/Abracon/view-part?ref=eda>; AVAILABILITY: Good; DESCRIPTION: 26MHz ±10ppm Crystal 10pF 50 Ohms 4-SMD, No Lead; MF: Abracon; MP: ABM3B-26.000MHZ-10-1-U-T; PACKAGE: SMD-4 Abracon LLC; PRICE: None; PURCHASE-URL: https://pricing.snapeda.com/search/part/ABM3B-26.000MHZ-10-1-U-T/?ref=eda

## Board
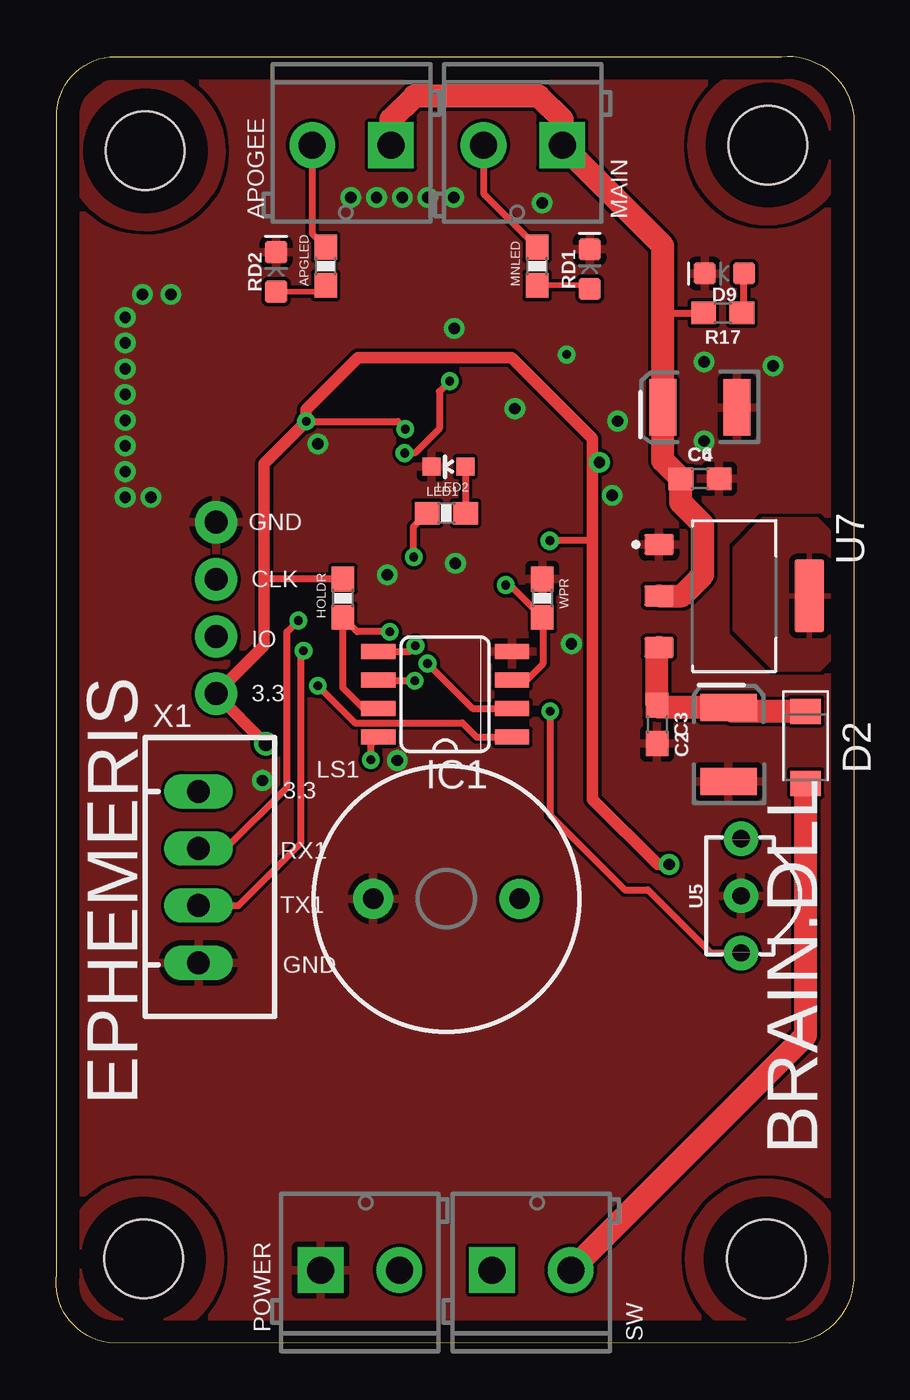
[diagram p5: board, top side]
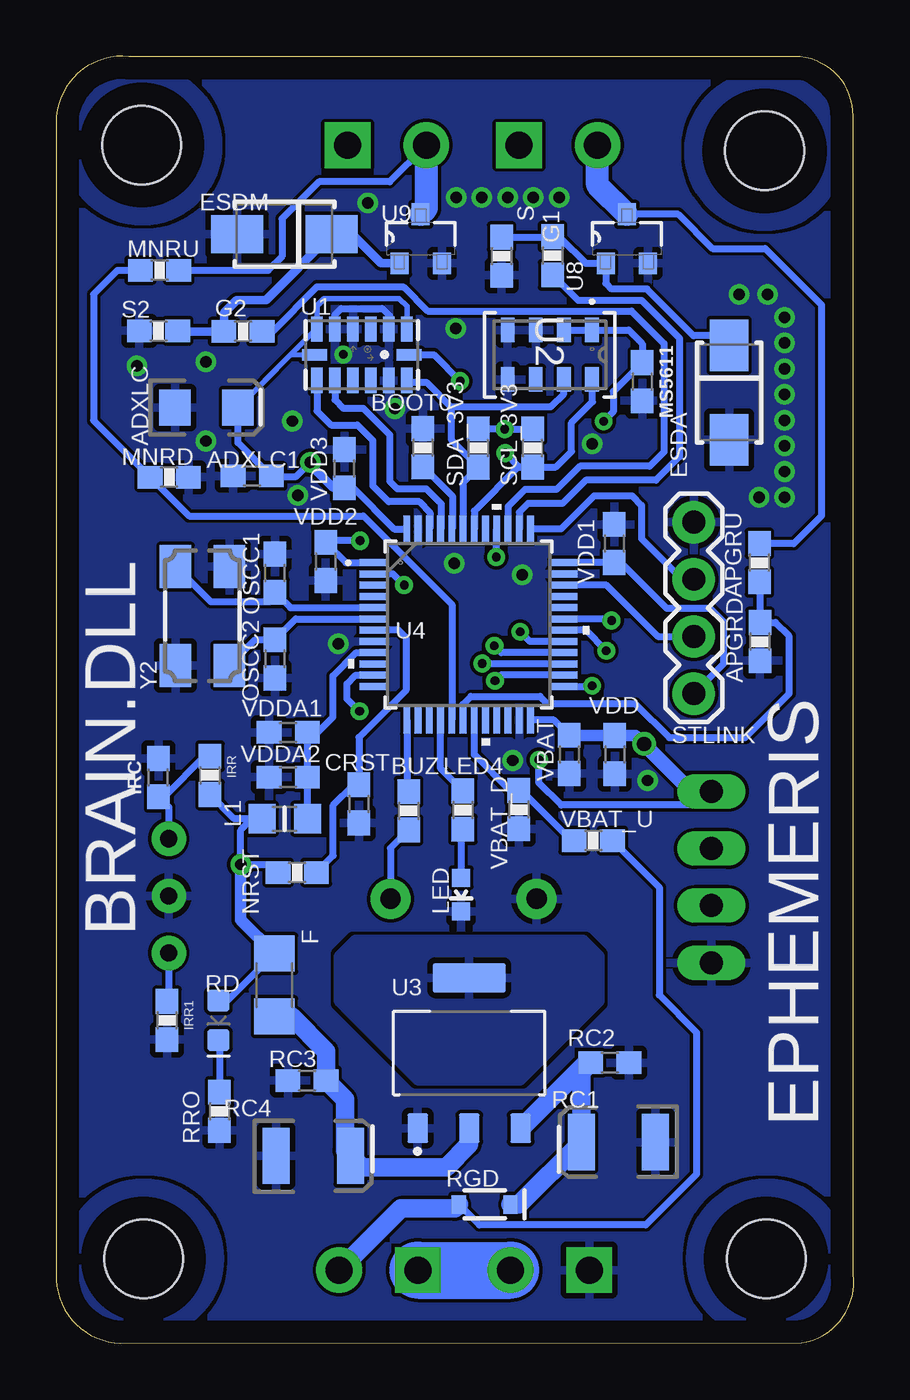
[diagram p6: board, bottom side, seen from below]

Size 35.46 x 57.22 mm. Coordinates in mm from the lower left corner, seen from the top.
Outline: 35.46,54.56 35.46,3.07 arc-90 32.61,0 2.33,0.03 arc-90 0.02,3.07 0.02,54.56 arc-90 2.61,57.2 32.23,57.2 arc-90 35.46,54.56
Copper layers (1*16): Top 0.035mm / dielectric 1.5mm / Bottom 0.035mm
Design rules "default": minimum track width 6mil, minimum drill 0.35mm, track to track 6mil, track to pad 6mil, pad to pad 6mil, via to via 6mil, smd to smd 6mil, copper to edge 40mil, drill to drill 6mil, minimum pad ring 10mil, minimum via ring 8mil, stop-mask expansion 4mil, vias tented up to drill 0mil, thermal gap 10mil
Holes 3.5 mm at 3.88,3.75 31.57,3.75 31.65,53.26 3.96,53.01

### Footprints (pad centres in the part's own frame; a part is rotated, then mirrored left to right if it is on the bottom)
EIA3216 = smd 1.4 x 1.6: + 1.4,0; - -1.4,0
0603 = smd 1.1 x 1: 1 -0.85,0; 2 0.85,0
0603-RES = smd 1.1 x 1: 1 -0.85,0; 2 0.85,0
SCREWTERMINAL-3.5MM-2-NS = drill 1.2 pad 2.032 square: 1 0,0 | drill 1.2 pad 2.032: 2 3.5,0
EIA3528 = smd 1.2 x 2.5: A 1.65,0; C -1.65,0
SODFL3718X115 = smd 1.115 x 1.361: 1 -1.6,0; 2 1.6,0
LED-0603 = smd 1 x 1: A -0.877,0; C 0.877,0
WE-TVSP_DO-214AC_UNIDIRECTIONAL = smd 2.3 x 1.7: 1 -2.1,0; 2 2.1,0
1206 = smd 1.6 x 1.8: 1 -1.4,0; 2 1.4,0
SO08-SKINNYPADS = smd 0.66 x 1.524: 1 -1.905,-2.973; 2 -0.635,-2.973; 3 0.635,-2.973; 4 1.905,-2.973; 5 1.905,2.973; 6 0.635,2.973; 7 -0.635,2.973; 8 -1.905,2.973
RC-MASTER-SMD_L0805MP = smd 1.2 x 1.3: 1 -1.016,0; 2 1.016,0
LED-0603' = smd 0.8 x 0.8: A 0,-0.75; C 0,0.75
BUZZER-12MM = drill 0.9 pad 1.778: + 3.25,0; - -3.25,0
SOD-323 = smd 0.63 x 0.83: A 1.15,0; C -1.15,0
1X04 = drill 1.016 pad 1.88: 1 0,0; 2 2.54,0; 3 5.08,0; 4 7.62,0
LGA14_1:1_PATRICK = smd 0.5 x 1.124: 1 2,1.138; 2 1.2,1.138; 3 0.4,1.138; 4 -0.4,1.138; 5 -1.2,1.138; 6 -2,1.138; 8 -2,-1.13; 9 -1.2,-1.138; 10 -0.4,-1.138; 11 0.4,-1.138; 12 1.2,-1.138; 13 2,-1.138 | smd 1.124 x 0.5: 7 -2.1,0; 14 2.1,0
SON8_MS5611_TEC = smd 1.092 x 0.61: 1 -1.1,1.875; 2 -1.1,0.625; 3 -1.1,-0.625; 4 -1.1,-1.875; 5 1.1,-1.875; 6 1.1,-0.625; 7 1.1,0.625; 8 1.1,1.875
SOT229P700X180-4N = smd 0.93 x 1.31: 1 -2.29,-3.345; 2 0,-3.345; 3 2.29,-3.345 | smd 3.24 x 1.31: 4 0,3.345
LQFP48-7X7MM = smd 1.194 x 0.305: 1 -4.25,2.75; 2 -4.25,2.25; 3 -4.25,1.75; 4 -4.25,1.25; 5 -4.25,0.75; 6 -4.25,0.25; 7 -4.25,-0.25; 8 -4.25,-0.75; 9 -4.25,-1.25; 10 -4.25,-1.75; 11 -4.25,-2.25; 12 -4.25,-2.75; 25 4.25,-2.75; 26 4.25,-2.25; 27 4.25,-1.75; 28 4.25,-1.25; 29 4.25,-0.75; 30 4.25,-0.25; 31 4.25,0.25; 32 4.25,0.75; 33 4.25,1.25; 34 4.25,1.75; 35 4.25,2.25; 36 4.25,2.75 | smd 0.305 x 1.194: 13 -2.75,-4.25; 14 -2.25,-4.25; 15 -1.75,-4.25; 16 -1.25,-4.25; 17 -0.75,-4.25; 18 -0.25,-4.25; 19 0.25,-4.25; 20 0.75,-4.25; 21 1.25,-4.25; 22 1.75,-4.25; 23 2.25,-4.25; 24 2.75,-4.25; 37 2.75,4.25; 38 2.25,4.25; 39 1.75,4.25; 40 1.25,4.25; 41 0.75,4.25; 42 0.25,4.25; 43 -0.25,4.25; 44 -0.75,4.25; 45 -1.25,4.25; 46 -1.75,4.25; 47 -2.25,4.25; 48 -2.75,4.25
TSOP382 = drill 0.762 pad 1.524: 1 -2.54,0; 2 0,0; 3 2.54,0
SOT95P240X112-3N = smd 0.972 x 0.802: D 1.092,0; G -1.092,0.94; S -1.092,-0.94
JST-XH-04-PACKAGE-LONG-PAD = drill 1.016 long: 1 -3.81,0; 2 -1.27,0; 3 1.27,0; 4 3.81,0
OSCCC500X320X110-4N = smd 1.9 x 1.4: 1 -2.2,-1.2; 2 2.2,-1.2; 3 2.2,1.2; 4 -2.2,1.2

### Placement (x,y rotation side)
ADXLC  28.78,41.61 0 bottom
ADXLC1  26.74,38.56 180 bottom
APGLED  11.99,47.88 90 top
APGRD  4.16,31.19 90 bottom
APGRU  4.19,34.7 90 bottom
APOGEE  14.88,53.26 180 top
BOOT0  19.15,39.81 270 bottom
BUZ  19.78,23.67 270 bottom
C2  29.89,26.62 90 top
C3  26.72,27.51 270 top
C4  28.62,38.43 0 top
C6  28.62,41.61 180 top
CRST  21.99,23.98 270 bottom
D2  33.32,26.49 270 top
D9  29.71,47.56 180 top
ESDA  5.53,42.27 270 bottom
ESDM  25.31,49.3 180 bottom
F  25.75,15.93 90 bottom
G1  13.39,48.35 270 bottom
G2  27.15,44.98 0 bottom
HOLDR  12.75,33.12 90 top
IC1  17.29,28.85 90 top
IRC  30.91,25.15 90 bottom
IRR  28.62,25.25 270 bottom
IRR1  30.53,14.35 270 bottom
L1  25.3,23.32 0 bottom
LED  GREEN  [LED-0603']  17.45,19.94 180 bottom
LED1  17.35,36.91 0 top
LED2  RED  [LED-0603']  17.45,38.96 90 top
LED4  17.37,23.7 270 bottom
LS1  17.35,19.76 0 top
MAIN  22.5,53.26 180 top
MNLED  21.38,47.88 90 top
MNRD  30.43,38.51 180 bottom
MNRU  30.86,47.7 0 bottom
MS5611  9.4,42.75 270 bottom
NRST  24.74,20.93 180 bottom
OSCC1  25.73,34.24 90 bottom
OSCC2  25.73,30.43 270 bottom
POWER  11.76,3.25 0 top
R17  29.64,45.8 180 top
RC1  10.46,8.94 180 bottom
RC2  10.84,12.47 0 bottom
RC3  24.3,11.68 180 bottom
RC4  24.03,8.33 0 bottom
RD  28.24,14.35 270 bottom
RD1  23.72,47.75 90 top
RD2  9.78,47.62 90 top
RGD  16.41,6.17 180 bottom
RRO  28.19,10.31 270 bottom
S  15.66,48.32 270 bottom
S2  30.91,45.01 180 bottom
SCL_3V3  14.27,39.8 90 bottom
SDA_3V3  16.68,39.8 90 bottom
STLINK  7.11,36.5 270 bottom
SW  19.38,3.25 0 top
U1  21.87,43.94 0 bottom
U2  13.51,43.94 270 bottom
U3  17.09,12.9 0 bottom
U4  17.12,31.95 0 bottom
U5  30.45,19.89 90 top
U7  AMS1117-5.0  [SOT229P700X180-4N]  30.15,33.22 270 top
U8  10.08,49.1 90 bottom
U9  19.25,49.1 90 bottom
VBAT  12.64,26.17 270 bottom
VBAT_D  14.88,23.72 90 bottom
VBAT_U  11.58,22.35 0 bottom
VDD  10.62,26.17 270 bottom
VDD1  10.64,35.55 90 bottom
VDD2  23.48,34.75 270 bottom
VDD3  22.64,38.88 90 bottom
VDDA1  25.14,27.15 180 bottom
VDDA2  25.14,25.17 180 bottom
WPR  21.61,33.12 270 top
X1  6.32,20.73 270 top
Y2  28.95,32.33 270 bottom

### Tracks (layer width: path | path; a pad name or v marks a point on that pad's centre or on a via)
3.3V  (via drill 0.38, 0.41, 0.51, 0.64)
  Top 0.305: STLINK.4 7.11,28.85 | 23.85,35.68 v21.95,35.68 | v11.11,40.98 15.18,40.98 v15.52,40.64 | v13.99,25.93 13.99,26.62 IC1.8 | HOLDR.2 9.28,33.97 9.24,33.93
  Top 0.508: v27.25,21.29 26.74,21.29 23.85,24.18 23.85,35.68 23.85,39.19 | 23.85,39.19 23.85,40.21 22.88,41.17 20.24,43.82 13.42,43.82 11.11,41.51 v11.11,40.98 9.24,39.11 9.24,33.93 9.24,31.01 STLINK.4 | v9.32,26.64 7.11,28.85 | v24.15,39.17 23.87,39.17 23.85,39.19
  Bottom 0.229: U1.7 25.04,43.94 ADXLC.+ 23.9,45.08 U1.6
  Bottom 0.254: U1.1 19.87,46.1 20.21,46.44 23.55,46.44 23.87,46.12 U1.6
  Bottom 0.305: F.2 27.85,15.23 RD.A | VDD3.1 22.25,38.03 20.43,36.2 U4.48 | STLINK.4 5.79,30.2 5.79,32.08 6.38,32.68 8.32,32.68 10.35,34.7 VDD1.1 U4.36 | VBAT.1 13.32,27.7 U4.24 | VDD.1 | v24.15,39.17 24.79,38.53 25.87,38.53 ADXLC1.1 27.37,40.04 ADXLC.+ | v21.95,35.68 23.4,35.68 VDD2.1 22.58,34.7 U4.1 | NRST.2 25.94,21.29 v27.25,21.29 27.25,22.81 26.74,23.32 L1.1 27.54,23.32 IRR.2 | U2.2 U2.1 10,45.04 9.39,44.44 MS5611.1 10.68,42.31 10.68,41.41 v11.11,40.98 | SCL_3V3.2 14.28,40.64 v15.52,40.64 16.67,40.64 SDA_3V3.2 | X1.1 6.93,23.93 13,23.93 13.99,24.92 v13.99,25.93
  Bottom 0.381: VDD3.1 23.15,38.03 24.15,39.04 v24.15,39.17
  Bottom 0.508: v27.25,21.29 27.25,18.82 F.2 | VDD.1 VBAT.1 | v9.32,26.64 9.69,27.02 VDD.1
  Bottom 0.635: v9.32,26.64 7.21,24.54 X1.1
5V
  Top 0.305: 26.97,45.8 R17.2
  Top 1.016: U7.2 27.82,33.22 28.75,34.16 28.75,36.4 27.77,37.38 C4.1 26.97,39.23 C6.A 26.97,45.8 26.97,48.79 MAIN.1 22.5,54.41 21.46,55.45 15.92,55.45 14.88,54.41 APOGEE.1
APG
  Bottom 0.305: G1.2 12.24,46.35 9.42,46.35 7.74,44.68 7.74,39.42 8.79,38.37 11.91,38.37 12.94,37.34 14.47,37.34 14.87,36.95 U4.38
BOOT0
  Bottom 0.305: BOOT0.2 19.13,38.96 17.84,37.67 17.84,36.23 U4.44
BUZZER
  Bottom 0.305: U4.13 19.87,24.61 BUZ.1
CS  (via drill 0.38)
  Top 0.305: v11.63,29.24 13.28,27.58 18.06,27.58 18.69,26.95 IC1.1
  Bottom 0.305: U4.25 11.66,29.2 v11.63,29.24
D
  pour Bottom: 35.15,53.26 arc90 31.65,56.77 arc90 28.14,53.24 arc90 31.62,49.76 arc90
  pour Bottom: 7.46,53.01 arc90 3.93,56.52 arc90 0.45,52.98 arc90 3.96,49.5 arc90
  pour Bottom: 7.39,3.76 arc90 3.86,7.26 arc90 0.38,3.78 arc90 3.91,0.25 arc90
  pour Bottom: 35.07,3.76 arc90 31.57,7.26 arc90 28.06,3.76 arc90 31.57,0.25 arc90
  pour Top: 0.38,3.78 arc-90 3.86,7.26 3.88,7.26 arc-90 7.39,3.76 7.39,3.71 arc-90 3.93,0.25 3.91,0.25 arc-90
  pour Top: 28.03,3.75 arc-90 31.57,7.26 arc-90 35.05,3.73 arc-90 31.52,0.26 arc-90
  pour Top: 28.14,53.24 arc-90 31.67,56.77 arc-90 35.15,53.26 arc-90 31.59,49.76 arc-90
  pour Top: 0.45,53.04 arc-90 3.93,56.52 arc-90 7.46,52.98 arc-90 3.91,49.5 arc-90
GND  (via drill 0.38, 0.51)
  Bottom 0.305: U1.5 23.07,45.72 22.78,46 20.96,46 20.62,45.67 20.62,45.13 U1.2
  other vias: 11.63,39.98 20.4,41.55 17.7,45.13 17.75,34.67 14.73,34.16 22.69,43.95 24.97,41 28.8,43.64 31.87,43.46 28.8,40.11 15.16,25.91 22.91,31.09 9.17,25.02 21.61,50.69 24.71,37.69 13.1,50.94 14.24,50.94 15.38,50.94 16.53,50.94 17.67,50.94 3.07,45.61 3.07,44.47 3.07,43.32 3.07,42.18 3.07,41.04 3.07,39.89 3.07,38.75 3.07,37.61 4.21,37.61 3.83,46.62 5.1,46.62
  pour Bottom (rank 2): 35.71,57.45 35.71,-0.28 -0.33,-0.28 -0.33,57.45
  pour Top (rank 2): 35.84,57.53 35.84,-0.48 -0.43,-0.48 -0.43,57.53
HOLD  (via drill 0.38)
  Top 0.305: IC1.7 13.66,28.22 12.75,29.13 HOLDR.1 13.38,31.64 v14.83,31.64
  Bottom 0.305: U4.29 14.4,31.2 v14.83,31.64
HT
  pour Bottom: 19.38,11.63 14.81,11.63 11.25,15.19 11.25,17.22 12.01,17.98 22.17,17.98 22.93,17.22 22.93,15.19
HT1
  pour Top: 30.15,31.7 30.15,35.38 31.42,36.65 33.83,36.65 34.85,35.64 34.85,30.81 33.96,29.92 31.92,29.92
IN1
  Bottom 0.305: U1.8 23.87,41.45 23.24,40.82 22.07,40.82 21.38,40.13 21.38,38.11 20.68,37.41 19.31,37.41 18.84,36.94 18.84,36.23 U4.46
IN2
  Bottom 0.305: U1.9 23.07,41.94 22.69,41.57 21.81,41.57 20.63,40.39 20.63,38.32 20.3,37.99 19,37.99 18.34,37.32 18.34,36.23 U4.45
IR_OUT  (via drill 0.38)
  Top 0.305: v21.97,28.09 21.97,23.47 25.28,20.16 26.3,20.16 29.11,17.35 U5.1
  Bottom 0.305: v21.97,28.09 22.53,28.65 22.53,29.31 22.13,29.7 U4.11 | U5.1 30.45,15.28 IRR1.1
LED
  Bottom 0.305: U4.16 18.37,25.54 LED4.1
LED2  (via drill 0.38)
  Top 0.305: v15.9,34.95 15.9,36.31 LED1.1
  Bottom 0.305: U4.40 15.9,36.17 v15.9,34.95
MISO  (via drill 0.38)
  Top 0.305: v16.51,30.22 18.51,28.22 IC1.2
  Bottom 0.305: U4.27 16.49,30.2 v16.51,30.22
MN
  Bottom 0.305: G2.2 25.84,44.98 23.86,46.97 20.01,46.97 18.94,45.89 9.87,45.89 8.43,44.45 8.43,39.62 9.06,38.99 12.17,38.99 13.21,37.95 14.61,37.95 15.37,37.2 U4.39
MOSI  (via drill 0.38)
  Top 0.305: v15.97,31.01 15.69,30.73 14.35,30.73 IC1.5
  Bottom 0.305: U4.28 15.66,30.7 v15.97,31.01
N$1
  Bottom 0.813: F.1 25,14.53 23.45,12.98 RC3.1 22.62,10.85 22.62,8.57 RC4.A 21.87,7.82 18.11,7.82 17.09,8.84 U3.2
N$2
  Bottom 0.305: RD.C 28.19,13.42 RRO.1
N$3
  Top 0.254: RD1.A 23.42,47.03 MNLED.1
N$4
  Top 0.254: RD2.A 11.7,46.75 APGLED.1
N$5
  Bottom 0.305: IRR.1 28.86,26.1 30.67,24.3 IRC.1 30.45,23.84 U5.3
N$6
  Top 0.305: LED2.A LED1.2
N$7
  Top 1.016: D2.1 30.07,28.09 C2.A 26.81,28.27 C3.1 26.72,30.85 U7.3
N$8
  Bottom 0.381: S2.1 30.03,44.98 G2.1 28,45.82 27.44,46.38 26.13,46.38 ESDM.1 22.3,49.3 21,48.01 U9.G
N$9
  Bottom 2.54: SW.1 POWER.2
N$10
  Bottom 0.229: LED4.2 17.45,22.77
  Bottom 0.305: 17.45,22.77 LED.A
N$11
  Top 0.305: R17.1 30.58,45.89 D9.A
N$13
  Bottom 0.305: BUZ.2 20.59,22.01 LS1.+
N$14
  Bottom 0.305: 5.96,44.79 7.12,44.79 9.19,46.86 10.77,46.86 11.02,47.12 U8.G 11.91,48.01 13.05,49.15 13.34,49.15 G1.1 | S.1 13.41,49.17
  Bottom 0.508: ESDA.1 5.96,44.79
  Bottom 0.813: G1.1 13.41,49.17
NRST
  Bottom 0.305: NRST.1 23.14,21.68 23.14,23.93 22.24,24.83 CRST.1 21.99,26.93 19.88,29.04 19.88,31.35 20.24,31.7 U4.7
OSC_OUT
  Bottom 0.305: Y2.3 26.61,31.28 OSCC2.1 24.8,32.2 U4.6
OSC_ıN
  Bottom 0.229: 25.63,33.29 OSCC1.1
  Bottom 0.305: Y2.1 28.59,32.97 25.96,32.97 25.63,33.29 25.04,32.7 U4.5
RX1  (via drill 0.38)
  Top 0.305: X1.2 7.54,22 10.26,24.71 10.26,31.62 v10.77,32.13
  Bottom 0.305: v10.77,32.13 10.84,32.2 U4.31
SCK  (via drill 0.38)
  Top 0.305: v15.95,29.45 14.36,29.45 IC1.6
  Bottom 0.305: U4.26 15.7,29.7 v15.95,29.45
SCL_3V3  (via drill 0.38)
  Top 0.305: v17.5,42.77 17.04,42.32 17.04,40.67 15.95,39.57 v15.49,39.57
  Bottom 0.305: SCL_3V3.1 14.92,38.95 16.87,37 U4.42 | U2.8 11.68,42.72 11.68,42.49 11.6,42.42 11.6,41.86 12.54,40.92 12.54,39.65 13.24,38.95 SCL_3V3.1 | U1.14 18.67,43.94 v17.5,42.77 | v15.49,39.57 14.87,38.95 SCL_3V3.1
SDA_3V3
  Bottom 0.305: U1.13 19.79,42.73 19,42.73 17.88,41.61 | U4.43 17.37,38.27 SDA_3V3.1 17.88,40.15 17.88,41.61 | U2.7 12.88,42.21 13.46,41.63 17.85,41.63 17.88,41.61
SWCLK
  Bottom 0.305: STLINK.2 7.62,33.96 9.43,35.76 9.43,37.25 9.85,37.67 11.53,37.67 13,36.2 U4.37
SWDIO
  Bottom 0.305: STLINK.3 8.71,31.42 10.99,33.7 U4.34
TX1  (via drill 0.38)
  Top 0.305: X1.3 8.1,19.46 10.87,22.23 10.87,30.66 v10.99,30.79
  Bottom 0.305: v10.99,30.79 11.91,31.7 U4.30
VAPG
  Top 0.305: APOGEE.2 11.38,49.33 APGLED.2
  Bottom 0.305: APGRU.2 2.66,35.55 1.42,36.79 1.42,46.15 3.93,48.67 6.27,48.67 7.79,50.19 U8.D
  Bottom 1.016: U8.D 11.38,51.49 APOGEE.2
VAPGS
  Bottom 0.229: APGRU.1 4.16,33.82
  Bottom 0.305: 4.16,33.82 APGRD.2 3.48,32.04 2.87,31.43 2.87,28.88 4.82,26.92 8.2,26.92 9.7,28.43 13.62,28.43 13.94,28.75 17.01,28.75 17.37,28.4 U4.18
VDDA
  Bottom 0.229: 23.84,27.15 VDDA1.1 | L1.2 24.29,23.33
  Bottom 0.305: 23.84,27.15 23.15,27.84 23.15,29.67 22.12,30.7 U4.9 | VDDA1.1 VDDA2.1 24.29,23.33
VIN
  Top 1.016: SW.2 33.32,13.7 D2.2
  Bottom 0.305: VBAT_U.2 8.65,20.27 8.65,15.48 6.98,13.82 6.98,7.52 9.24,5.26 16.64,5.26 RGD.A
  Bottom 0.813: SW.2 20.13,5.99 17.73,5.99 RGD.A
VMN
  Top 0.305: MAIN.2 19,51.11 MNLED.2
  Bottom 0.305: MNRU.2 26.03,47.7 25.42,48.31 25.42,49.99 23.77,51.64 20.63,51.64 MAIN.2
  Bottom 1.016: U9.D 19,50.44 MAIN.2
VMNS
  Bottom 0.305: MNRU.1 32.72,47.7 33.79,46.63 33.79,41.02 MNRD.2 29.55,36.78 21.8,36.78 17.86,32.85 17.86,27.72 17.87,27.72 U4.17
VNR
  Bottom 0.813: RGD.C 14.88,6.17 RC1.A 12.11,12.05 RC2.1 11.89,12.47 U3.3
VSENS
  Bottom 0.305: VBAT_U.1 12.56,22.35 14.78,24.57 VBAT_D.2 15.27,24.57 16.87,26.17 U4.19
WP  (via drill 0.38)
  Top 0.305: IC1.3 20.93,29.49 21.66,30.23 21.66,32.22 WPR.2 20.18,33.71 v19.99,33.71
  Bottom 0.305: v19.99,33.71 20.48,34.2 U4.2

### Text on the board
tPlace: GND | CLK | IO | 3.3 | BRAIN.DLL | 3.3 | RX1 | TX1 | GND | EPHEMERIS
bPlace: BRAIN.DLL | EPHEMERIS